# EAGLE design PR9025_B (EAGLE 6.6.0)
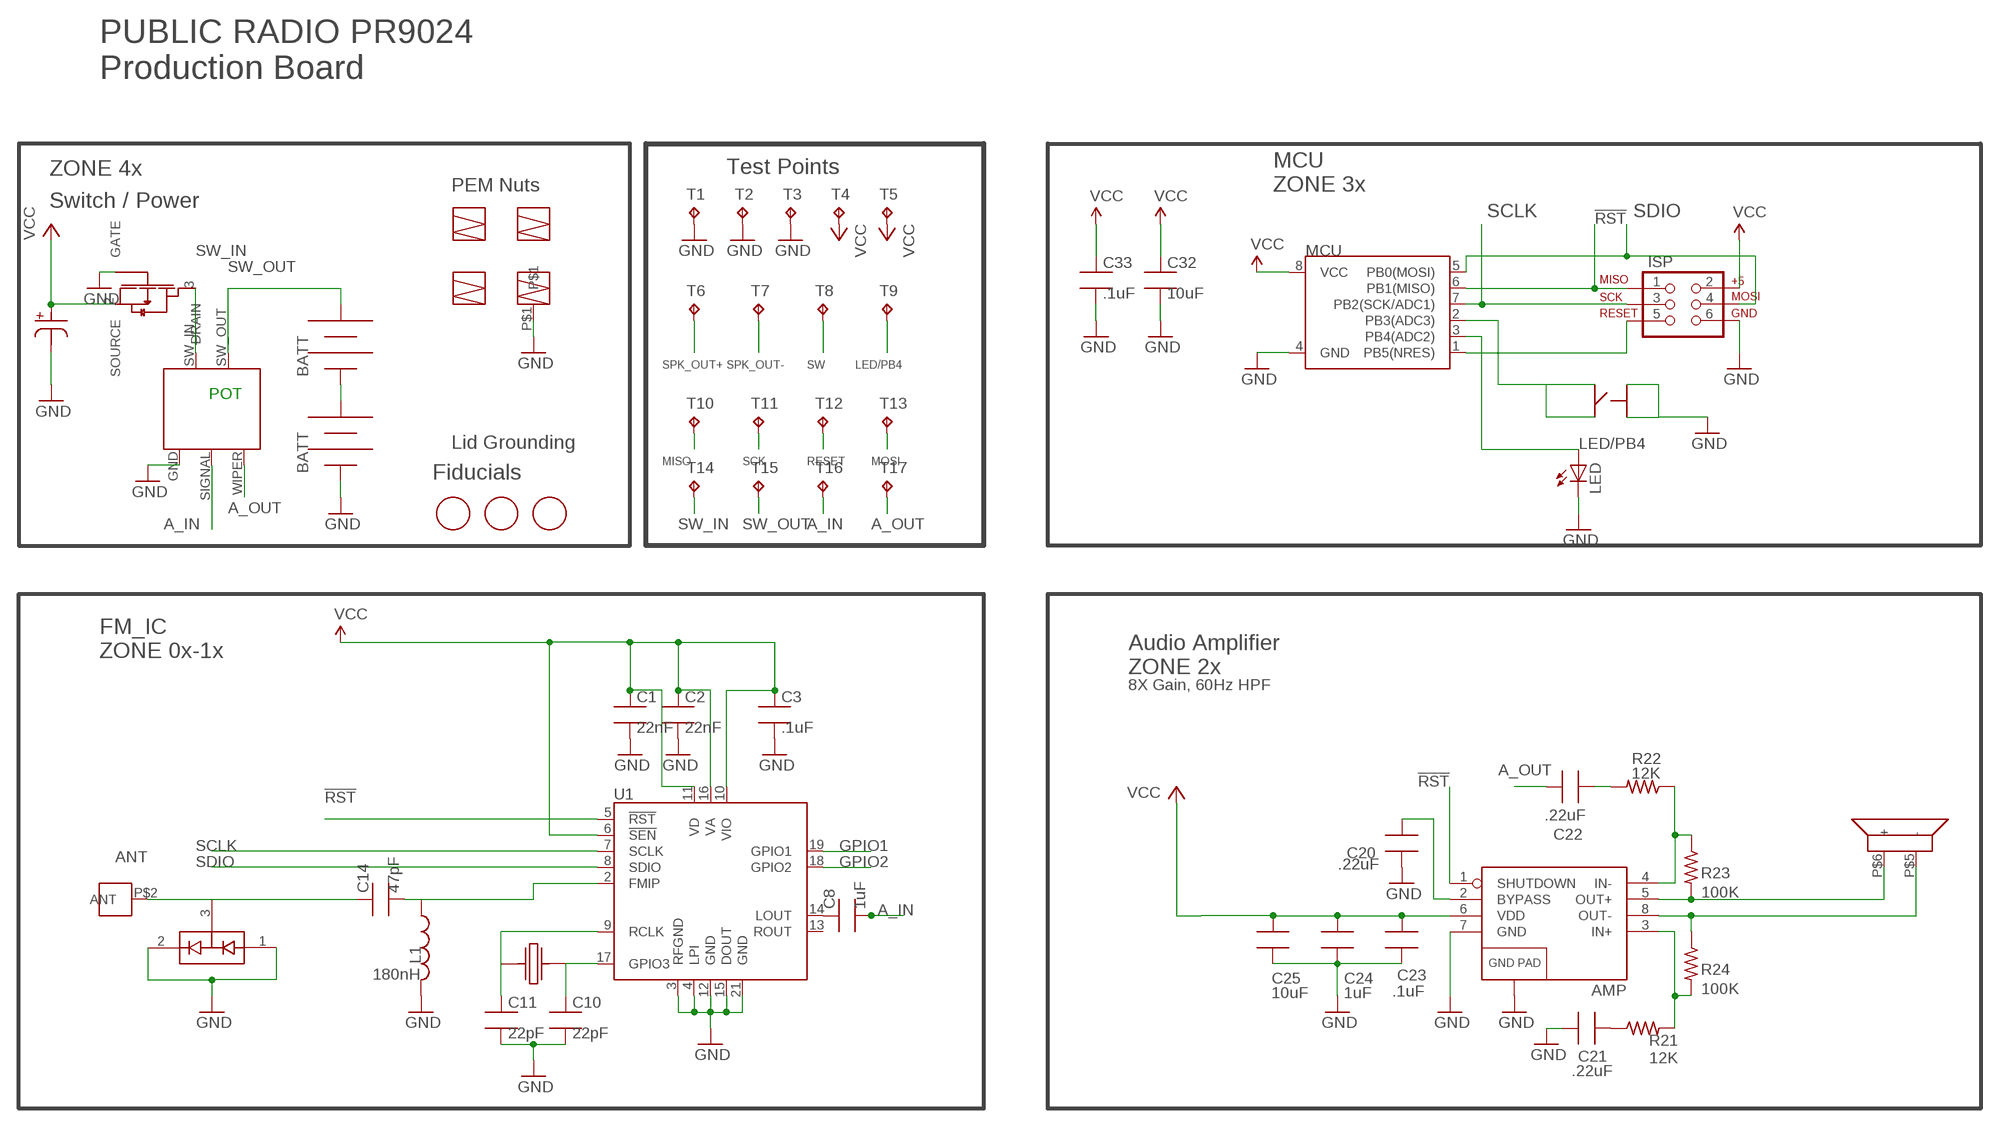
[diagram p0: schematic, sheet 1]

## Parts
AMP  TPA6203A1  [8-MSOP]
ANT_MOUNT  DNP  M3_PEMNUT  [PEM_M3]
C1  22nF  C_SMT_0603_CPL  [0603_CPL]
C2  22nF  C_SMT_0603_CPL  [0603_CPL]
C3  .1uF  C_SMT_0603_CPL  [0603_CPL]
C8  1uF  C_SMT_0603_CPL  [0603_CPL]
C10  22pF  C_SMT_0603_CPL  [0603_CPL]
C11  22pF  C_SMT_0603_CPL  [0603_CPL]
C14  47pF  C_SMT_0603_CPL  [0603_CPL]
C20  .22uF  C_SMT_0603_CPL  [0603_CPL]
C21  .22uF  C_SMT_0603_CPL  [0603_CPL]
C22  .22uF  C_SMT_0603_CPL  [0603_CPL]
C23  .1uF  C_SMT_0603_CPL  [0603_CPL]
C24  1uF  C_SMT_0603_CPL  [0603_CPL]
C25  10uF  C_SMT_0603_CPL  [0603_CPL]
C32  10uF  C_SMT_0603_CPL  [0603_CPL]
C33  .1uF  C_SMT_0603_CPL  [0603_CPL]
C40  220uF  NICHICON_SERIESUD  [NICHICON_UD_63]
D1  BAV99  [SOT23_CPL]
FET1  AO3435  [SOT23_CPL]
ISP  AVR_SPI_PRG_6NS  [2X3-NS]
JP5  BK-92_MPD_AA_BATT_CLIP  [BK92_AA_BATT]
JP6  BK-92_MPD_AA_BATT_CLIP  [BK92_AA_BATT]
L1  180nH  L_SMT_0805_ADAFRUIT  [0805_ADAFRUIT]
LED  HSMC-C265_REVERSE_MOUNT_LED  [HSMC-C265_REVERSE_MOUN_LED]
MARK1  FIDUCIAL  [FIDUCIAL_1MM]
MARK2  FIDUCIAL  [FIDUCIAL_1MM]
MARK3  FIDUCIAL  [FIDUCIAL_1MM]
MCU  ATTINY45TINY45-20-SMT  [8-SOIC]
R1  VOLUME_POT  [H17112NS_A10K_L20F-002]
R21  12K  R_SMT_R0603_CPL  [0603_CPL]
R22  12K  R_SMT_R0603_CPL  [0603_CPL]
R23  100K  R_SMT_R0603_CPL  [0603_CPL]
R24  100K  R_SMT_R0603_CPL  [0603_CPL]
SPKR_PLACE  DNP  PR2024_SPKR_SMD  [PR2024_SPKR_PLACE(SMD)]
SW1  C&K_PTS645  [C&K_PTS645_SMT]
T1  TPTP20R  [TP20R]
T2  TPTP20R  [TP20R]
T3  TPTP20R  [TP20R]
T4  TPTP20R  [TP20R]
T5  TPTP20R  [TP20R]
T6  TPTP20R  [TP20R]
T7  TPTP20R  [TP20R]
T8  TPTP20R  [TP20R]
T9  TPTP20R  [TP20R]
T10  TPTP20R  [TP20R]
T11  TPTP20R  [TP20R]
T12  TPTP20R  [TP20R]
T13  TPTP20R  [TP20R]
T14  TPTP20R  [TP20R]
T15  TPTP20R  [TP20R]
T16  TPTP20R  [TP20R]
T17  TPTP20R  [TP20R]
U1  SI4702-C19-GMR  [SI470X_20_QFN]
U$2  PEM_SMT  [PEM_SMT]
U$3  PEM_SMT  [PEM_SMT]
U$4  PEM_SMT  [PEM_SMT]
U$5  PEM_M3_SMT_W/PIN  [PEM_SMT]
X1  ABS25XTAL  [4-SOJ]

## Nets
!RST: AMP.1(SHUTDOWN) ISP.1 MCU.6(PB1(MISO)) T10.TP U1.5(!RST)
A_IN: C8.2 R1.SIGNAL T16.TP
A_OUT: C22.2 R1.WIPER T17.TP
ANT [antenna]: ANT_MOUNT.P$2(ANT) C14.1 D1.3(COM)
GND: AMP.7(GND) AMP.9(GND) C1.2 C2.2 C3.2 C10.2 C11.2 C20.1 C21.1 C23.2 C24.2 C25.2 C32.2 C33.2 C40.P$2 D1.1(A1) D1.2(C2) FET1.1(GATE) ISP.6 JP6.NEG JP6.NEG@2(NEG) L1.2 LED.P$2(C) MCU.4(GND) R1.GND SW1.P$1 SW1.P$2 T1.TP T2.TP T3.TP U1.3(RFGND) U1.4(LPI) U1.12(GND) U1.15(DOUT) U1.21(GND) U$5.P$1
GPIO1: U1.19(GPIO1)
GPIO2: U1.18(GPIO2)
LED/PB4: LED.P$1(A) MCU.3(PB4(ADC2)) T9.TP
N$1: C11.1 U1.9(RCLK) X1.P$1
N$3: C22.1 R22.2
N$5: AMP.3(IN+) R21.2 R24.2
N$9: C8.1 U1.14(LOUT)
N$10: C10.1 U1.17(GPIO3) X1.P$4
N$12: AMP.2(BYPASS) C20.2
N$13: JP5.NEG JP5.NEG@2(NEG) JP6.POS JP6.POS@2(POS)
N$14: AMP.4(IN-) R22.1 R23.1
N$16: C14.2 L1.1 U1.2(FMIP)
N$23: C21.2 R21.1
RESET: ISP.5 MCU.1(PB5(NRES)) T12.TP
SCLK: ISP.3 MCU.7(PB2(SCK/ADC1)) T11.TP U1.7(SCLK)
SDIO: ISP.4 MCU.5(PB0(MOSI)) T13.TP U1.8(SDIO)
SPK_OUT+: AMP.5(OUT+) R23.2 SPKR_PLACE.P$6(+) T6.TP
SPK_OUT-: AMP.8(OUT-) R24.1 SPKR_PLACE.P$5(-) T7.TP
SW: MCU.2(PB3(ADC3)) SW1.P$3 SW1.P$4 T8.TP
SW_IN: FET1.3(DRAIN) R1.SW_IN T14.TP
SW_OUT: JP5.POS JP5.POS@2(POS) R1.SW_OUT T15.TP
VCC: AMP.6(VDD) C1.1 C2.1 C3.1 C23.1 C24.1 C25.1 C32.1 C33.1 C40.P$1 FET1.2(SOURCE) ISP.2 MCU.8(VCC) T4.TP T5.TP U1.6(!SEN) U1.10(VIO) U1.11(VD) U1.16(VA)
Unconnected: U1.13(ROUT)

## Notes on the sheet
- PUBLIC RADIO PR9024
  Production Board
- ZONE 4x | Test Points
- PEM Nuts
- MCU
  ZONE 3x
- Switch / Power
- POT
- Lid Grounding
- MISO | SCK | RESET | MOSI
- Fiducials
- FM_IC
  ZONE 0x-1x
- Audio Amplifier 
  ZONE 2x
- 8X Gain, 60Hz HPF

## Library data of the parts
AMP = PR_Parts_Library:TPA6203A1: IC AMP AUDIO PWR 1.25W AB 8MSOP; MFG_PN: TPA6203A1DGNR
ANT_MOUNT = PR_Parts_Library:M3_PEMNUT
C1 C2 = PR_Parts_Library:C_SMT: SMT capacitor; MFG_PN: CL10B223KB8NNNC; TOL: 10%; VOLTAGE: 16V
C3 C23 C33 = PR_Parts_Library:C_SMT: SMT capacitor; MFG_PN: CL10B104KB8SFNC; TOL: 10%; VOLTAGE: 16V
C8 C24 = PR_Parts_Library:C_SMT: SMT capacitor; MFG_PN: CL10B105KP8NNNC; TOL: 10%; VOLTAGE: 10V
C10 C11 = PR_Parts_Library:C_SMT: SMT capacitor; MFG_PN: C1608C0G1H220J080AA; TOL: 5%; VOLTAGE: 50V
C14 = PR_Parts_Library:C_SMT: SMT capacitor; MFG_PN: CL10C470JB8NCNC; TOL: 5%; VOLTAGE: 50V
C20-C22 = PR_Parts_Library:C_SMT: SMT capacitor; MFG_PN: C1608X7R1C224K080AC; TOL: 10%; VOLTAGE: 16V
C25 C32 = PR_Parts_Library:C_SMT: SMT capacitor; MFG_PN: CL10A106MQ8NNNC; TOL: 20%; VOLTAGE: 6.3V
C40 = PR_Parts_Library:NICHICON_SERIESUD: Nichicon UD Series 220uf Cap MFG# UUD1C221MCL1GS; MFG_PN: UUD1C221MCL1GS; TOL: 20%; VOLTAGE: 16V
D1 = PR_Parts_Library:BAV99: DIODE ARRAY GP 100V 215MA SOT23; MFG_PN: BAV99,215
FET1 = PR_Parts_Library:AO3435: MOSFET P-CH 20V 2.9A SOT23; MFG_PN: AO3435
ISP = PR_Parts_Library:AVR_SPI_PRG_6: DIL VERTICAL PC TAIL PIN HEADER; MFG_PN: M20-9980346
JP5 JP6 = PR_Parts_Library:BK-92_MPD_AA_BATT_CLIP: Thru hole AA battery clip pair.; MFG_PN: 2 of BK92 - supplied by CL Labs
L1 = PR_Parts_Library:L_SMT: SMT inductor; CURRENT: 400mA; DCR: 640m; MFG_PN: AISC-0805-R18J-T; TOL: 5%
LED = PR_Parts_Library:HSMC-C265_REVERSE_MOUNT_LED: HSMC-C265; MFG_PN: HSMC-C265
MARK1-MARK3 = PR_Parts_Library:FIDUCIAL: 1mm fiducial.; MFG_PN: DNP
MCU = PR_Parts_Library:ATTINY45: Atmel 8-pin 2/4/8kB flash uC; MFG_PN: ATTINY45-20SUR
R1 = PR_Parts_Library:VOLUME_POT: Switched potentiometer, vertical mount, 10K audio taper
R21 R22 = PR_Parts_Library:R_SMT: SMT resistor; MFG_PN: RC0603FR-0712KL; POWER: 1/10W; TOL: 1%
R23 R24 = PR_Parts_Library:R_SMT: SMT resistor; MFG_PN: ERJ-3EKF1003V; POWER: 1/10W; TOL: 1%
SPKR_PLACE = PR_Parts_Library:PR2024_SPKR_SMD
SW1 = PR_Parts_Library:C&K_PTS645: SWITCH TACTILE SPST-NO 0.05A 12V; MFG_PN: PTS645SM43SMTR92 LFS
T1-T17 = PR_Parts_Library:TP: Test pad; MFG_PN: DNP
U1 = PR_Parts_Library:SI4702-C19-GMR: IC FM RADIO TUNER 20-QFN; MFG_PN: Si4702 C19 GM - supplied by CL Labs
U$2-U$4 = PR_Parts_Library:PEM_SMT
U$5 = PR_Parts_Library:PEM_M3_SMT_W/PIN
X1 = PR_Parts_Library:ABS25XTAL: 4PIN 32.768 Xtal MFG# ABS25-32.768KHZ-T; MFG_PN: ABS25-32.768KHZ-T

## Net classes
1 antenna: clearance 1.27 mm
2 audio: clearance 0.254 mm

## Board
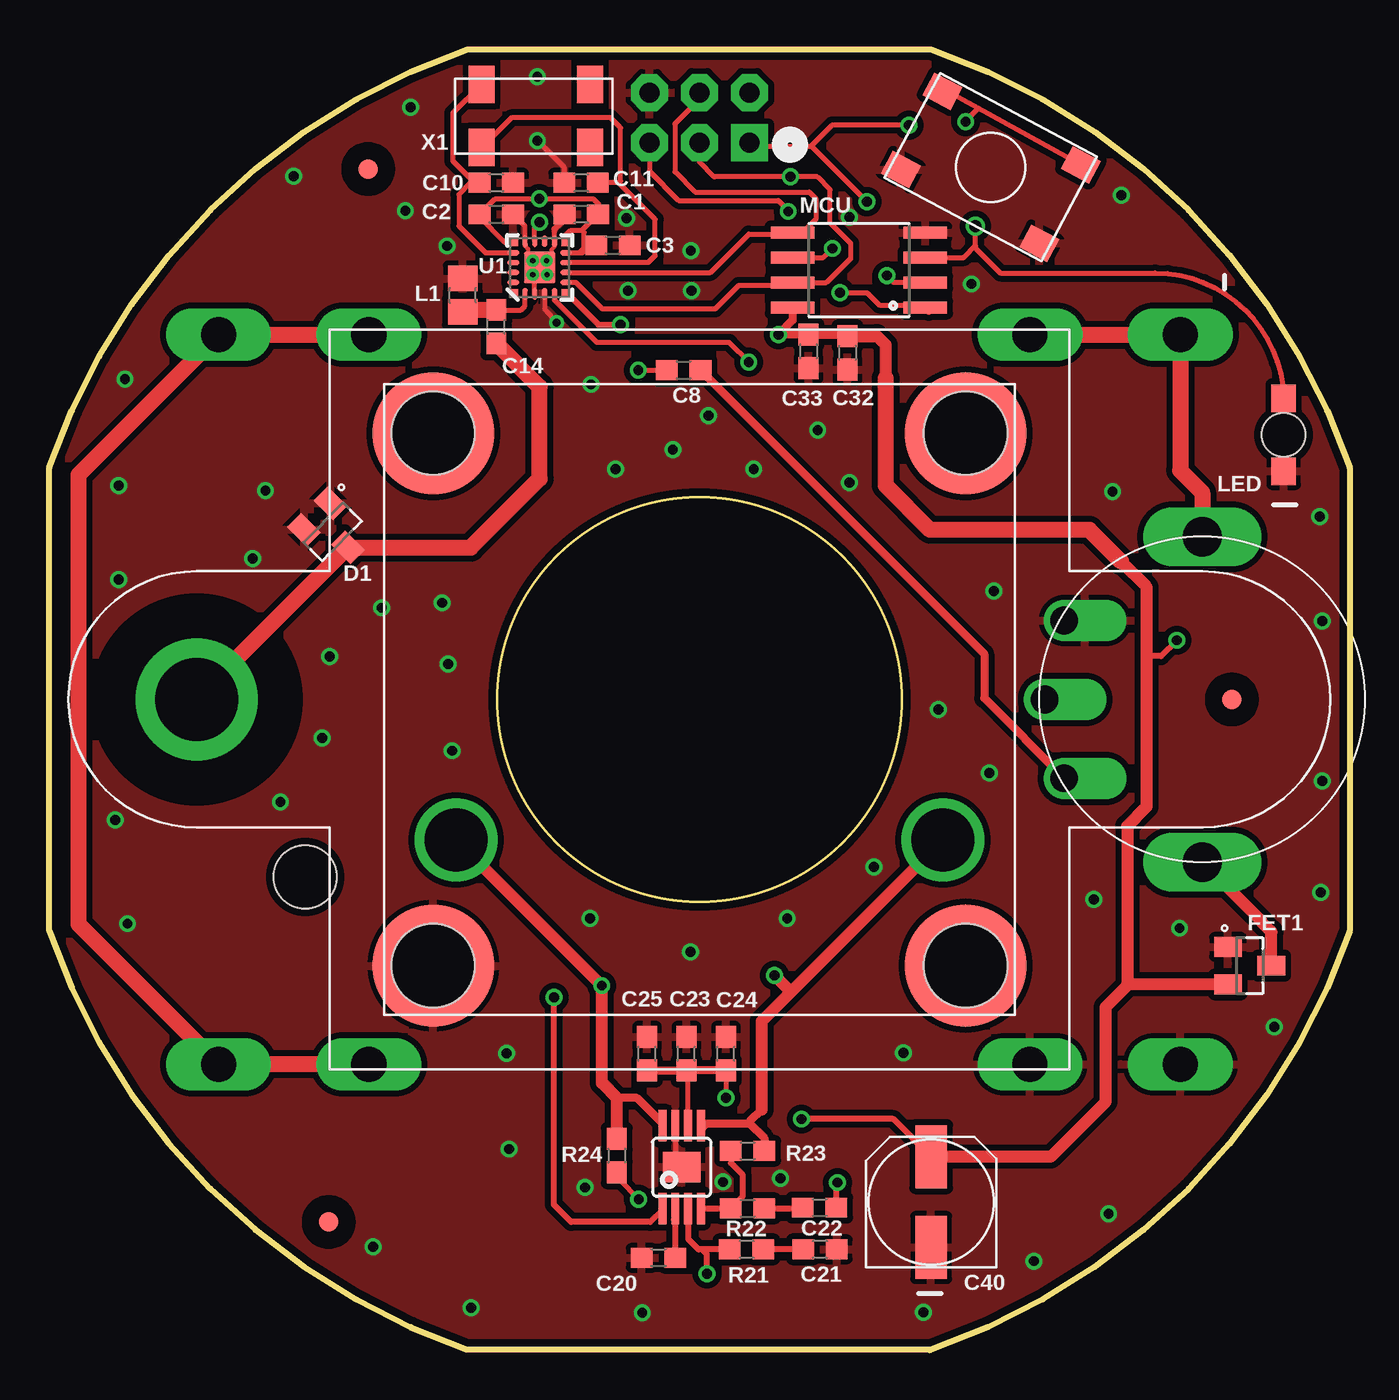
[diagram p1: board, top side]
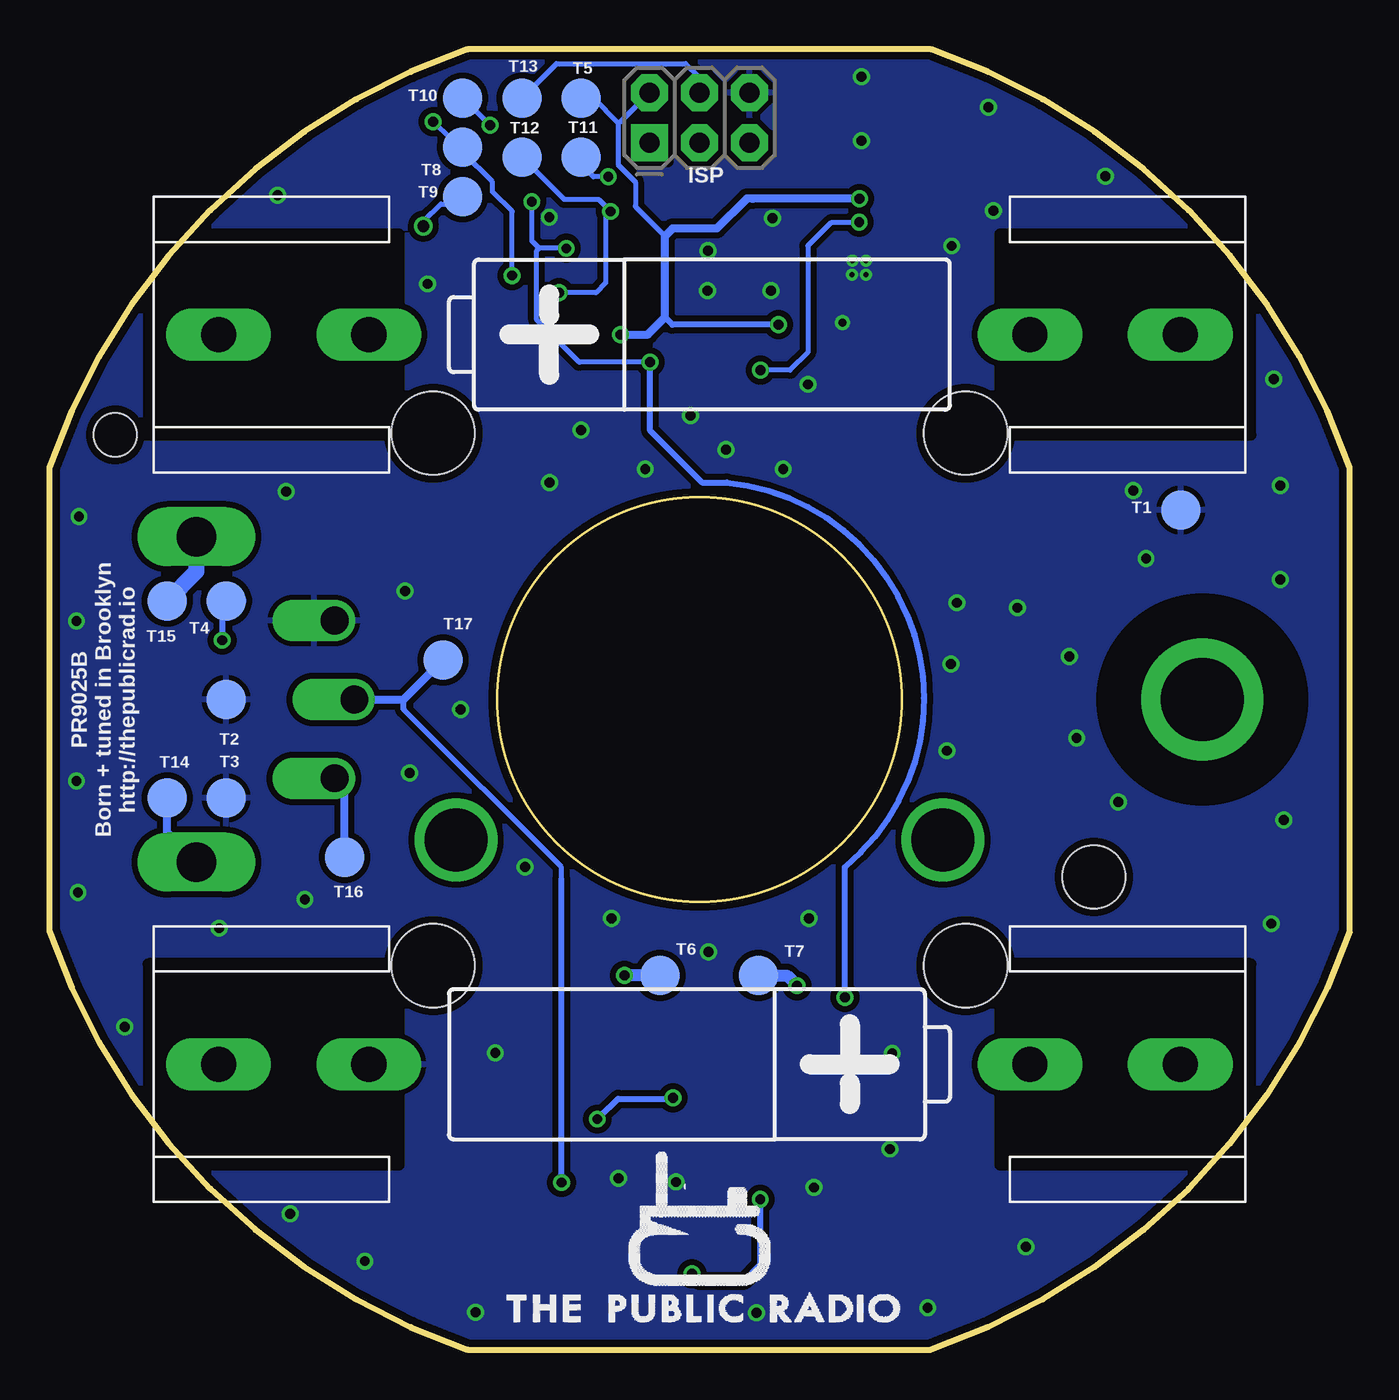
[diagram p2: board, bottom side, seen from below]

Size 65.94 x 65.97 mm. Coordinates in mm from the lower left corner, seen from the top.
Outline: 44.61,0 44.72,0.03
Outline: 44.72,0.03 21.22,0.03 arc-52 0,21.25 0,44.75 arc-52 21.22,65.97 44.72,65.97 arc-52 65.94,44.75 65.94,21.25 arc-52 44.72,0.03
Copper layers (1*16): Top 0.0356mm / dielectric 1.5011mm / Bottom 0.0356mm
Design rules "oshpark-2layer *": minimum track width 6mil, minimum drill 13mil, track to track 6mil, track to pad 6mil, pad to pad 6mil, via to via 6mil, smd to smd 6mil, copper to edge 15mil, drill to drill 6mil, minimum pad ring 7mil, minimum via ring 7mil, stop-mask expansion 4mil, vias tented up to drill 30mil, thermal gap 10mil
Holes 3.2 mm at 12.97,24
tRestrict: area 24.1,54.1 to 25.7,55.7; 8 lines

### Footprints (pad centres in the part's own frame; a part is rotated, then mirrored left to right if it is on the bottom)
8-MSOP = smd 0.4 x 1.6: 1 -0.975,-2.1; 2 -0.325,-2.1; 3 0.325,-2.1; 4 0.975,-2.1; 5 0.975,2.1; 6 0.325,2.1; 7 -0.325,2.1; 8 -0.975,2.1 | smd 1.89 x 1.57: 9 0,0
PEM_M3 = drill 4.22 pad 6.2: P$2 0,0
0603_CPL = smd 1.1 x 1: 1 -0.85,0; 2 0.85,0
NICHICON_UD_63 = smd 1.6 x 3.2: P$1 0,2.3; P$2 0,-2.3
SOT23_CPL = smd 1.4 x 1: 1 -1.1,0.95; 2 -1.1,-0.95; 3 1.1,0
2X3-NS = drill 1.016 pad 1.88 square: 1 -2.54,-1.27 | drill 1.016 pad 1.88 octagon: 2 -2.54,1.27; 3 0,-1.27; 4 0,1.27; 5 2.54,-1.27; 6 2.54,1.27
BK92_AA_BATT = drill 1.778 long: NEG -24.384,0; NEG@2 -16.764,0; POS 16.764,0; POS@2 24.384,0
0805_ADAFRUIT = smd 1.3 x 1.5: 1 -0.85,0; 2 0.85,0
HSMC-C265_REVERSE_MOUN_LED = smd 1.4 x 1.25: P$1 -1.85,0; P$2 1.85,0 | hole 2.2: 0,0
FIDUCIAL_1MM = smd 1 x 1: 1 0,0
8-SOIC = smd 0.61 x 2.21: 1 -1.905,-3.378; 2 -0.635,-3.378; 3 0.635,-3.378; 4 1.905,-3.378; 5 1.905,3.353; 6 0.635,3.353; 7 -0.635,3.353; 8 -1.905,3.353
H17112NS_A10K_L20F-002 = drill 1.4 offset: GND -4,-7; SIGNAL 4,-7; WIPER 0,-8 | drill 2 long: SW_IN 8.25,0; SW_OUT -8.25,0
PR2024_SPKR_PLACE(SMD) = drill 3.2: P$5 -12.341,-7.125; P$6 12.341,-7.125
C&K_PTS645_SMT = smd 1.6 x 1.3: P$1 -3.975,2.25; P$2 3.975,2.25; P$3 -3.975,-2.25; P$4 3.975,-2.25
TP20R = smd 2 x 2: TP 0,0
SI470X_20_QFN = smd 0.34 x 0.34: 1 -1.275,1.265; 6 -1.265,-1.265; 11 1.265,-1.265; 16 1.265,1.265 | smd 0.61 x 0.28: 2 -1.335,0.75; 3 -1.335,0.25; 4 -1.335,-0.25; 5 -1.335,-0.75; 12 1.335,-0.75; 13 1.335,-0.25; 14 1.335,0.25; 15 1.335,0.75 | smd 0.28 x 0.61: 7 -0.75,-1.335; 8 -0.25,-1.335; 9 0.25,-1.335; 10 0.75,-1.335; 17 0.75,1.335; 18 0.25,1.335; 19 -0.25,1.335; 20 -0.75,1.335 | smd 1.6 x 1.6: 21 0,0
PEM_SMT = smd 6.2 x 6.2: P$1 0,0 | hole 4.22: 0,0
4-SOJ = smd 1.3 x 1.9: P$1 -2.75,-1.6; P$2 2.75,-1.6; P$3 2.75,1.6; P$4 -2.75,1.6

### Placement (x,y rotation side)
AMP  32.07,9.29 0 top
ANT_MOUNT  7.47,33 0 top
C1  26.98,57.6 180 top
C2  22.67,57.6 0 top
C3  28.58,56.03 0 top
C8  32.17,49.7 0 top
C10  22.67,59.2 0 top
C11  26.97,59.2 180 top
C14  22.67,51.9 90 top
C20  30.89,4.69 0 top
C21  39.08,5.12 180 top
C22  39.06,7.23 0 top
C23  32.31,15.04 90 top
C24  34.31,15.04 90 top
C25  30.31,15.04 90 top
C32  40.47,50.58 270 top
C33  38.49,50.65 270 top
C40  44.72,7.51 0 top
D1  14.37,41.5 315 top
FET1  60.87,19.5 0 top
ISP  32.97,62.5 0 bottom
JP5  32.97,51.5 180 bottom
JP6  32.97,14.5 0 bottom
L1  20.97,53.5 90 top
LED  62.59,46.42 270 top
MARK1  14.17,6.5 0 top
MARK2  16.17,59.9 0 top
MARK3  59.97,33 0 top
MCU  41.04,54.77 90 top
R1  58.47,33 270 top
R21  35.36,5.12 180 top
R22  35.41,7.19 0 top
R23  35.41,10.11 0 top
R24  28.78,9.87 270 top
SPKR_PLACE  32.97,33 0 top
SW1  47.74,59.99 152 top
T1  8.57,42.6 0 bottom
T2  56.97,33 0 bottom
T3  56.97,28 0 bottom
T4  56.97,38 0 bottom
T5  38.97,63.5 0 bottom
T6  34.97,19 0 bottom
T7  29.97,19 0 bottom
T8  44.97,61 0 bottom
T9  44.97,58.5 0 bottom
T10  44.97,63.5 0 bottom
T11  38.97,60.5 0 bottom
T12  41.97,60.5 0 bottom
T13  41.97,63.5 0 bottom
T14  59.97,28 0 bottom
T15  59.97,38 0 bottom
T16  50.97,25 0 bottom
T17  45.97,35 0 bottom
U1  24.87,54.9 90 top
U$1  [PR_LOGO]  32.97,7 0 bottom
U$2  19.47,46.5 0 top
U$3  46.47,46.5 0 top
U$4  46.47,19.5 0 top
U$5  19.47,19.5 0 top
X1  24.67,62.58 0 top

### Tracks (layer width: path | path; a pad name or v marks a point on that pad's centre or on a via)
!RST  (via drill 0.5)
  Top 0.254: MCU.6 39.25,55.41 v39.72,55.88 | U1.5 25.62,53.25 27.77,51.1 34.47,51.1 v35.47,50.1 | AMP.1 31.09,6.88 | v41.47,58.25 38.71,61.01 arc45 38.66,61.03 38.59,61.03 | v43.59,62.12 39.72,62.12 arc45 39.67,62.11 38.59,61.03 | 38.59,61.03 35.71,61.03 ISP.1
  Top 0.305: AMP.1 31.09,7.12 30.47,6.5 26.47,6.5 25.59,7.38 v25.59,17.9
  Bottom 0.254: v39.72,55.88 41.09,55.88 | v35.47,50.1 39.07,50.1 41.22,52.25 41.22,55.75 41.09,55.88 | 41.09,55.88 41.45,56.23 arc45 41.47,56.28 v41.47,58.25 | T10.TP 44.62,63.5 arc45 44.58,63.48 44.58,63.13 arc-45 44.56,63.09 v43.59,62.12
  Bottom 0.305: v35.47,50.1 35.47,46.62 32.86,44.02 arc-45 32.82,44 31.59,44 arc135 25.59,24.5 v25.59,17.9
A_IN
  Top 0.406: C8.2 47.41,35.31 47.41,33.06 R1.SIGNAL
  Bottom 0.406: T16.TP 50.97,28.5 R1.SIGNAL
A_OUT  (via drill 0.5)
  Top 0.305: C22.2 39.91,8.44 v39.97,8.5
  Bottom 0.254: 39.97,23.88 39.97,24.5 47.97,32.5
  Bottom 0.305: v39.97,8.5 39.97,23.88 | 47.97,32.5 47.97,33
  Bottom 0.406: T17.TP 47.97,33 R1.WIPER
ANT
  Top 0.406: 22.82,51.05 C14.1
  Top 0.813: ANT_MOUNT.P$2 7.47,33.04 D1.3 15.17,40.7 21.37,40.7 24.87,44.2 24.87,48.85 C14.1
GND  (via drill 0.25, 0.25 pad 0.1, 0.4, 0.5)
  Top 0.2: U1.12 25.62,55.95 25.47,55.8 25.47,55.5 v25.22,55.25 | 24.31,55.46 v24.52,55.25 24.28,55.49 24.28,55.84 24.12,56 U1.15 | 25.12,54.44 v25.23,54.55
  Top 0.254: v25.22,55.25 U1.21 | v24.52,55.25 v24.52,55.24 24.54,55.23 | U1.15 24.12,57 C2.2 | C1.2 25.97,57.6 | U1.4 25.12,52.8 v25.72,52.1 | AMP.7 31.74,9.61 AMP.9 | C11.2 26.12,59.96 v24.75,61.33 | U1.3 24.62,54.45 v24.52,54.55 | U1.12 25.62,56.85
  Top 0.305: 31.74,9.13 AMP.9 | 25.62,56.85 26.13,57.36 C1.2
  Top 0.406: 31.74,9.13 31.74,8.73 31.77,8.71
  other vias: 33.42,47.4 16.42,5.24 21.39,2.15 24.75,64.58 23.19,15.06 40.57,44 18.32,63.03 18.05,57.78 12.39,59.53 53.72,6.93 62.12,16.4 27.47,48.98 16.84,37.65 31.62,45.67 11.72,27.8 20.18,56 38.97,46.65 14.22,35.17 10.32,40.15 10.96,43.59 29.27,57.4 43.32,15.09 45.08,32.49 47.89,38.5 53.92,43.55 52.98,22.86 64.56,28.86 32.52,20.2 3.96,21.63 3.34,26.89 3.52,39.08 3.52,43.84 3.84,49.23 23.31,10.2 64.43,42.27 64.49,23.22 49.94,4.52 34.17,8.53 37.07,8.71 47.67,29.27 32.53,55.75 54.36,58.58 30.07,1.9 44.32,1.92 29.34,53.73 32.57,53.73 64.56,36.98 13.84,31.05 57.32,21.4 46.76,54.08 27.42,21.9 37.42,21.9 20.22,34.8 20.42,30.4 19.92,37.9 35.72,44.67 28.72,44.67 27.17,8.25 40.58,57.45 41.82,24.5
  pour Bottom (isolate 0.305): -2.03,68 67.97,68 67.97,-2 -2.03,-2
  pour Top (isolate 0.305): -2.03,68 -2.03,-2 67.97,-2 67.97,68
LED/PB4  (via drill 0.6)
  Top 0.254: MCU.3 46.35,55.41 arc45 46.4,55.43 46.97,56 | 46.97,56 v46.97,57 | 46.97,56 46.97,55.9 arc45 46.99,55.86 48.22,54.62 56.07,54.62 arc-88 LED.P$1
  Bottom 0.254: v46.97,57 46.97,57.22 arc45 46.95,57.27 46.09,58.12 45.37,58.12 arc-45 45.33,58.14 T9.TP
N$1
  Top 0.254: 27.67,59.3 C11.1 28.87,59.2 | U1.9 30.37,55.15 30.72,55.5 30.72,57.35 28.87,59.2 | X1.P$1 23.42,62.48 arc-45 23.46,62.5 28.47,62.5 28.95,62.02 arc-45 28.97,61.97 28.97,59.3 28.87,59.2
N$3
  Top 0.305: R22.2 38.17,7.19 C22.1
N$5  (via drill 0.5)
  Top 0.254: R24.2 28.91,8.64 v29.89,7.66
  Top 0.305: AMP.3 32.37,6.69 32.41,6.64 32.41,5.63 32.92,5.12 33.09,5.12 | R21.2 33.09,5.12 | v33.34,3.88 33.34,4.87 33.09,5.12
  Bottom 0.305: v29.89,7.66 29.89,4.33 30.72,3.5 32.97,3.5 v33.34,3.88
N$9  (via drill 0.5)
  Top 0.254: U1.14 24.62,56.95 v24.87,57.2 | v29.87,49.7 C8.1
  Bottom 0.254: v24.87,57.2 26.27,57.2 27.47,56 27.47,50.6 28.37,49.7 v29.87,49.7
N$10
  Top 0.254: U1.17 22.12,55.65 20.77,57 20.77,58.6 21.37,59.2 C10.1 | C10.1 21.77,59.2 | C10.1 21.47,59.3 20.47,60.3 20.47,62.7 arc-45 20.49,62.75 X1.P$4 | 21.67,59.3 C10.1
N$12
  Top 0.254: 31.67,6.63 AMP.2
  Top 0.305: 31.67,6.63 31.77,6.54 31.74,6.51 C20.2
N$13
  Top 0.813: JP6.POS JP6.POS@2 1.47,21.62 1.47,44.38 JP5.NEG JP5.NEG@2
N$14
  Top 0.254: 34.86,6.94 R22.1
  Top 0.305: AMP.4 R22.1 35.14,7.78 35.14,8.92 34.56,9.5 R23.1
N$16
  Top 0.254: C14.2 23.92,52.75 24.12,52.95 U1.2
  Top 0.813: C14.2 21.07,52.75 L1.1
N$21
  pour Bottom: 
N$23
  Top 0.305: C21.2 R21.1
RESET  (via drill 0.5)
  Top 0.254: v40.09,53.62 41.47,53.62 42.09,53 44.29,53 MCU.1 | ISP.5 30.43,59.79 31.92,58.3 36.97,58.3 37.47,57.8 v37.47,57.75
  Top 0.406: 44.59,52.7 MCU.1
  Bottom 0.254: v40.09,53.62 38.22,53.62 37.72,54.12 37.72,57.47 arc45 37.7,57.52 v37.47,57.75 38.07,58.35 39.82,58.35 T12.TP
SCLK  (via drill 0.5)
  Top 0.254: 37.68,54.12 MCU.7 | MCU.7 39.41,54.14 40.64,55.38 40.64,56.12 39.59,57.17 39.59,58.85 38.94,59.5 v37.59,59.5 33.75,59.5 arc-45 33.7,59.52 32.99,60.23 arc-45 32.97,60.28 ISP.3 | U1.7 26.69,54.15 28.03,52.81 33.78,52.81 34.97,54 37.55,54 MCU.7
  Bottom 0.254: v37.59,59.5 38.34,59.5 38.95,60.11 arc45 38.97,60.15 T11.TP
SDIO
  Top 0.254: MCU.5 38.12,56.68 arc45 38.17,56.7 | U1.8 33.52,54.65 35.47,56.6 37.61,56.6 MCU.5 | 37.61,56.62 arc45 37.66,56.64 MCU.5 | ISP.4 32.97,63.44 31.72,62.19 31.72,59.75 32.74,58.73 38.54,58.73 38.87,58.4 38.87,57.35 38.2,56.68 MCU.5
  Bottom 0.254: ISP.4 32.97,64.47 arc-45 32.99,64.52 32.99,64.57 33.67,65.25 40.22,65.25 T13.TP
SPK_OUT+  (via drill 0.5)
  Top 0.254: AMP.5
  Top 0.305: AMP.5 33.13,11.3 | 36.12,10.25 R23.2
  Top 0.406: 36.57,9.86 R23.2 36.26,10.76 35.52,11.5 | 33.13,11.3 33.33,11.5 35.52,11.5 | 36.12,12.2 35.52,11.6 35.52,11.5
  Top 0.61: SPKR_PLACE.P$6 37.45,18.02 | 37.45,18.02 36.12,16.68 36.12,12.2 | v36.77,19 37.45,18.32 37.45,18.02
  Bottom 0.61: T6.TP v36.77,19
SPK_OUT-  (via drill 0.5)
  Top 0.254: AMP.8 31.09,11.49
  Top 0.406: 31.09,10.94 AMP.8 | 31.09,11.49 29.8,12.79 28.78,12.79
  Top 0.61: SPKR_PLACE.P$5 v28.02,18.48 28.02,13.55 28.78,12.79 R24.1
  Bottom 0.61: T7.TP 28.54,19 v28.02,18.48
SW  (via drill 0.5)
  Top 0.254: 44.51,54.05 MCU.2 42.83,54.14 v42.47,54.5 | SW1.P$4 45.55,63.84 47.11,62.98 | 47.11,62.98 SW1.P$3 | v46.47,62.3 46.47,62.35 47.11,62.98
  Bottom 0.254: v42.47,54.5 42.47,57.75 43.45,58.73 arc45 43.47,58.78 43.47,59.25 44.95,60.73 arc45 44.97,60.78 T8.TP 45.34,60.62 45.59,60.62 45.59,61.42 v46.47,62.3
SW_IN
  Top 0.61: R1.SW_IN 61.45,21.77 arc-45 61.47,21.72 61.95,21.24 arc-45 61.97,21.2 FET1.3
  Bottom 0.406: R1.SW_IN 59.97,26.25 T14.TP
SW_OUT
  Top 0.813: JP5.POS JP5.POS@2 57.35,44.62 58.47,43.5 R1.SW_OUT
  Bottom 0.813: T15.TP 58.47,39.5 R1.SW_OUT
VCC  (via drill 0.5)
  Top 0.254: AMP.6 32.39,13.73 C23.1 | 23.2,56.16 U1.16 23.57,56.2 23.07,56.2 21.82,57.45 C2.1 22.61,58.39 v24.85,58.39 27.58,58.39 27.87,58.1 27.87,57.64 C1.1 | U1.10 26.32,55.65 | U1.11 26.13,56.48 26.44,56.79 27.02,56.79 | 27.02,56.79 C1.1 | 27.77,57.66 C1.1 | U1.10 27.04,55.65 27.42,56.03 C3.1 | U1.10 26.9,55.65 27.13,55.88 27.13,56.68 27.02,56.79 | 34.31,13.81 v34.31,12.79
  Top 0.305: C24.1 34.31,13.81 | 38.21,11.66 v38.15,11.72 42.78,11.72 arc-45 42.83,11.7 C40.P$1 | U1.6 26.18,53.63 arc-45 26.23,53.62 27.84,52 v28.97,52 | v57.17,36 56.37,35.2 55.66,35.2
  Top 0.406: C32.1 40.39,51.5 C33.1 v36.97,51.5 37.69,52.22 MCU.8 | C24.1 C23.1 | C23.1 32.23,13.81 | C25.1 C23.1
  Top 0.61: C40.P$1 50.78,9.81 53.57,12.6 53.57,17.4 54.69,18.52 | C32.1 41.97,51.42 42.42,50.98 42.42,49.27 | 54.34,40 55.66,38.69 55.66,35.2 55.66,27.56 54.66,26.56 54.66,18.59 arc45 54.68,18.54 54.69,18.52 | FET1.2 54.75,18.55 arc45 54.7,18.53 54.69,18.52
  Top 0.813: 42.42,49.27 42.42,43.85 44.67,41.6 52.74,41.6 54.34,40
  Bottom 0.254: 37.09,62.25 37.09,60.12 36.24,59.27 arc45 36.22,59.22 36.22,58.03 arc-45 36.2,57.98 34.72,56.5 | 37.09,62.25 38.33,63.48 arc-45 38.37,63.5 T5.TP | 56.34,38 57.17,37.17 | ISP.2 37.03,62.25 37.09,62.25
  Bottom 0.305: v38.15,11.72 37.58,12.29 37.55,12.29 37.09,12.75 34.35,12.75 v34.31,12.79 | v28.97,52 34.34,52 34.72,52.38 | 57.17,37.17 v57.17,36
  Bottom 0.406: v24.85,58.39 30.26,58.39 30.47,58.4 30.57,58.4 32.09,56.88 34.34,56.88 34.72,56.5 34.72,52.38 35.58,51.52 arc45 35.62,51.5 v36.97,51.5
  Bottom 0.813: T4.TP 56.34,38

### Text on the board
tNames: X1
bNames: PR9025B / Born + tuned in Brooklyn / http://thepublicrad.io